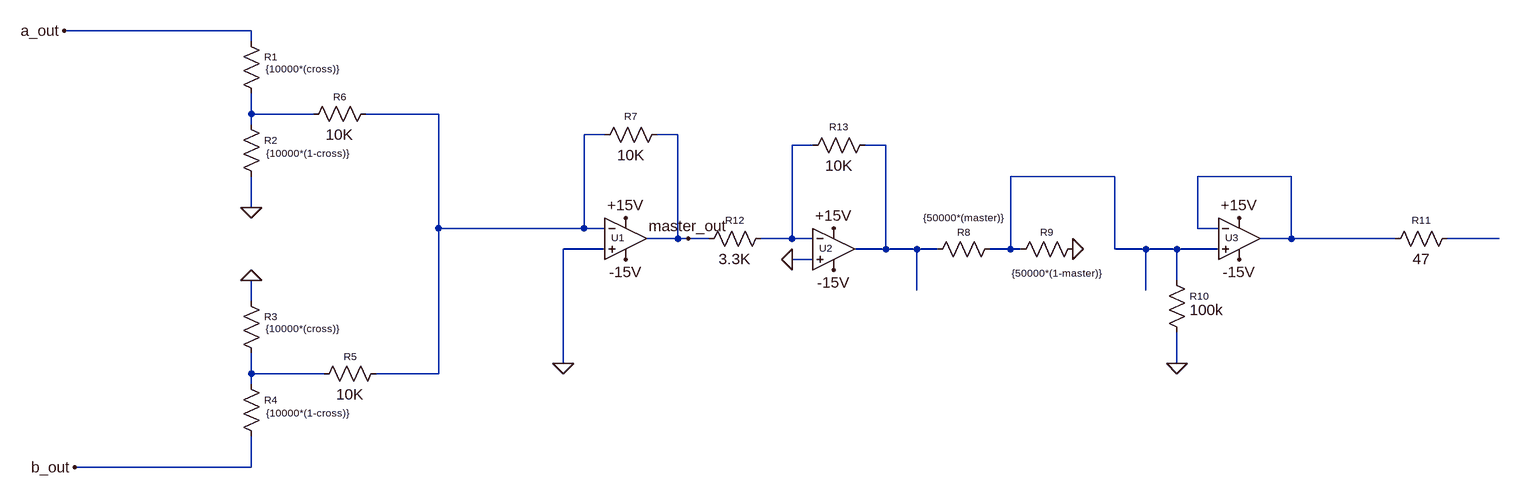
[diagram p0: schematic Virtual_Earth_and _Master_Output.asc]
Virtual_Earth_and _Master_Output.asc, the LTspice schematic file:
Version 4.1
SHEET 1 1156 716
WIRE -768 -16 -1056 -16
WIRE -768 0 -768 -16
WIRE -768 112 -768 80
WIRE -672 112 -768 112
WIRE -480 112 -592 112
WIRE -768 128 -768 112
WIRE -224 144 -256 144
WIRE -112 144 -144 144
WIRE 96 160 64 160
WIRE 208 160 176 160
WIRE 560 208 400 208
WIRE 832 208 688 208
WIRE -768 256 -768 208
WIRE -480 288 -480 112
WIRE -256 288 -256 144
WIRE -256 288 -480 288
WIRE -224 288 -256 288
WIRE 688 288 688 208
WIRE 720 288 688 288
WIRE -112 304 -112 144
WIRE -112 304 -160 304
WIRE -96 304 -112 304
WIRE -64 304 -96 304
WIRE 64 304 64 160
WIRE 64 304 16 304
WIRE 96 304 64 304
WIRE 832 304 832 208
WIRE 832 304 784 304
WIRE 992 304 832 304
WIRE 1152 304 1072 304
WIRE -224 320 -288 320
WIRE 208 320 208 160
WIRE 208 320 160 320
WIRE 256 320 208 320
WIRE 288 320 256 320
WIRE 400 320 400 208
WIRE 400 320 368 320
WIRE 416 320 400 320
WIRE 560 320 560 208
WIRE 608 320 560 320
WIRE 656 320 608 320
WIRE 720 320 656 320
WIRE 96 336 64 336
WIRE 656 368 656 320
WIRE 256 384 256 320
WIRE 608 384 608 320
WIRE -768 400 -768 368
WIRE -288 496 -288 320
WIRE 656 496 656 448
WIRE -768 512 -768 480
WIRE -656 512 -768 512
WIRE -480 512 -480 288
WIRE -480 512 -576 512
WIRE -768 528 -768 512
WIRE -768 656 -768 608
WIRE -768 656 -1040 656
FLAG -1056 -16 a_out
FLAG -1040 656 b_out
FLAG -768 256 0
FLAG -768 368 0
FLAG -288 496 0
FLAG -192 336 -15V
FLAG -192 272 +15V
FLAG 128 288 +15V
FLAG 128 352 -15V
FLAG 64 336 0
FLAG 496 320 0
FLAG 656 496 0
FLAG 752 336 -15V
FLAG 752 272 +15V
FLAG -96 304 master_out
SYMBOL res -784 -16 R0
WINDOW 0 36 40 Left 1
WINDOW 3 38 58 Left 1
SYMATTR InstName R1
SYMATTR Value {10000*(cross)}
SYMATTR SpiceLine tol=1
SYMBOL res -784 112 R0
WINDOW 0 36 40 Left 1
WINDOW 3 39 60 Left 1
SYMATTR InstName R2
SYMATTR Value {10000*(1-cross)}
SYMATTR SpiceLine tol=1
SYMBOL res -784 384 R0
WINDOW 0 36 40 Left 1
WINDOW 3 38 58 Left 1
SYMATTR InstName R3
SYMATTR Value {10000*(cross)}
SYMATTR SpiceLine tol=1
SYMBOL res -784 512 R0
WINDOW 0 36 40 Left 1
WINDOW 3 39 60 Left 1
SYMATTR InstName R4
SYMATTR Value {10000*(1-cross)}
SYMATTR SpiceLine tol=1
SYMBOL res -560 496 R90
WINDOW 0 0 56 VBottom 1
WINDOW 3 32 56 VTop 2
SYMATTR InstName R5
SYMATTR Value 10K
SYMATTR SpiceLine tol=1
SYMBOL res -576 96 R90
WINDOW 0 0 56 VBottom 1
WINDOW 3 32 56 VTop 2
SYMATTR InstName R6
SYMATTR Value 10K
SYMATTR SpiceLine tol=1
SYMBOL OpAmps\\UniversalOpAmp2 -192 304 R0
WINDOW 0 -22 -2 Left 1
SYMATTR InstName U1
SYMATTR Value2 Avol=200K GBW=10Meg Slew=9Meg
SYMATTR SpiceLine Ilimit=30m Rail=0 Vos=0
SYMBOL res -240 160 R270
WINDOW 0 34 56 VTop 1
WINDOW 3 0 56 VBottom 2
SYMATTR InstName R7
SYMATTR Value 10K
SYMATTR SpiceLine tol=1
SYMBOL OpAmps\\UniversalOpAmp2 128 320 R0
WINDOW 0 -22 -2 Left 1
SYMATTR InstName U2
SYMATTR Value2 Avol=200K GBW=10Meg Slew=9Meg
SYMATTR SpiceLine Ilimit=30m Rail=0 Vos=0
SYMBOL res 272 336 R270
WINDOW 0 32 56 VTop 1
WINDOW 3 75 55 VBottom 1
SYMATTR InstName R8
SYMATTR Value {50000*(master)}
SYMATTR SpiceLine tol=1
SYMBOL res 400 336 R270
WINDOW 0 32 56 VTop 1
WINDOW 3 -10 70 VBottom 1
SYMATTR InstName R9
SYMATTR Value {50000*(1-master)}
SYMATTR SpiceLine tol=1
SYMBOL res 640 352 R0
WINDOW 0 36 40 Left 1
WINDOW 3 36 62 Left 2
SYMATTR InstName R10
SYMATTR Value 100k
SYMATTR SpiceLine tol=1
SYMBOL OpAmps\\UniversalOpAmp2 752 304 R0
WINDOW 0 -22 -2 Left 1
SYMATTR InstName U3
SYMATTR Value2 Avol=200K GBW=10Meg Slew=9Meg
SYMATTR SpiceLine Ilimit=30m Rail=0 Vos=0
SYMBOL res 976 320 R270
WINDOW 0 34 56 VTop 1
WINDOW 3 0 56 VBottom 2
SYMATTR InstName R11
SYMATTR Value 47
SYMATTR SpiceLine tol=1
SYMBOL res -80 320 R270
WINDOW 0 34 56 VTop 1
WINDOW 3 0 56 VBottom 2
SYMATTR InstName R12
SYMATTR Value 3.3K
SYMATTR SpiceLine tol=1
SYMBOL res 80 176 R270
WINDOW 0 34 56 VTop 1
WINDOW 3 0 56 VBottom 2
SYMATTR InstName R13
SYMATTR Value 10K
SYMATTR SpiceLine tol=1

The netlist it stands for:
* Virtual_Earth_and _Master_Output.asc
R1 a_out N001 {10000*(cross)} tol=1
R2 N001 0 {10000*(1-cross)} tol=1
R3 0 N008 {10000*(cross)} tol=1
R4 N008 b_out {10000*(1-cross)} tol=1
R5 N002 N008 10K tol=1
R6 N002 N001 10K tol=1
X§U1 0 N002 +15V -15V master_out level2 Avol=200K GBW=10Meg Slew=9Meg Ilimit=30m Rail=0 Vos=0 En=0 Enk=0 In=0 Ink=0 Rin=500Meg  ; pins In+ In- V+ V- OUT
R7 N002 master_out 10K tol=1
X§U2 0 N003 +15V -15V N004 level2 Avol=200K GBW=10Meg Slew=9Meg Ilimit=30m Rail=0 Vos=0 En=0 Enk=0 In=0 Ink=0 Rin=500Meg  ; pins In+ In- V+ V- OUT
R8 N004 N005 {50000*(master)} tol=1
R9 N005 0 {50000*(1-master)} tol=1
R10 N005 0 100k tol=1
X§U3 N005 N006 +15V -15V N006 level2 Avol=200K GBW=10Meg Slew=9Meg Ilimit=30m Rail=0 Vos=0 En=0 Enk=0 In=0 Ink=0 Rin=500Meg  ; pins In+ In- V+ V- OUT
R11 N006 N007 47 tol=1
R12 master_out N003 3.3K tol=1
R13 N003 N004 10K tol=1
.lib UniversalOpAmp2.lib
.backanno
.end